# Altium schematic sheet power_sw.SchDoc
size A4
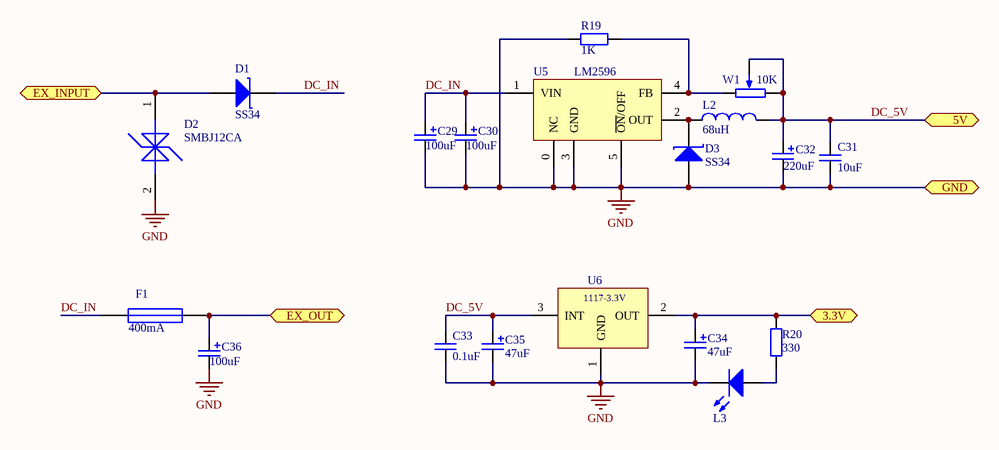
[diagram p0: power_sw.SchDoc]

## Parts
C29  value 100uF  [ECAP_S]  (hidden comment: CAP 330uF)
C30  value 100uF  [ECAP_S]  (hidden comment: CAP 330uF)
C31  value 10uF  [CAP-0805]  (hidden comment: CAP)
C32  value 220uF  [ECAP_S]  (hidden comment: CAP 330uF)
C33  value 0.1uF  [CAP-0805]  (hidden comment: CAP)
C34  value 47uF  [CAP_B]  (hidden comment: CAP 10UF)
C35  value 47uF  [CAP_B]  (hidden comment: CAP 10UF)
C36  value 100uF  [ECAP_S]  (hidden comment: CAP 330uF)
D1  SS34  [DO214AC]
D2  SMBJ12CA  [DO214AB]
D3  SS34  [DO214AC]
F1  400mA  [MF_R030]
L2  value 68uH  [PWR_L]  (hidden comment: INDUCTOR)
L3  LED  [LED-0805]  (value not drawn)
R19  value 1K  [RES-0805]  (hidden comment: RES)
R20  value 330  [RES-0805]  (hidden comment: RES)
U5  LM2596  [TO263]
U6  AMS117-3V3  [AMS1117]  (value not drawn)
W1  value 10K  [RESPOT1]  (hidden comment: RESPOT)

## Ports
3.3V, 5V, EX_INPUT, EX_OUT, GND

## Nets
GND: C29.2 C30.2 C31.1 C32.2 C33.1 C34.2 C35.2 C36.2 D2.2 D3.1 L3.2 R19.1 U5.0(NC) U5.3(GND) U5.5(~{ON}/OFF) U6.1(GND) ; port GND
3.3V: C34.1 R20.2 U6.2(OUT) ; port 3.3V
DC_5V: C31.2 C32.1 C33.2 C35.1 L2.2 U6.3(INT) W1.2 W1.3 ; port 5V
DC_IN: C29.1 C30.1 D1.2 F1.1 U5.1(VIN)
EX_INPUT: D1.1 D2.1 ; port EX_INPUT
EX_OUT: C36.1 F1.2 ; port EX_OUT
NetD3_2: D3.2 L2.1 U5.2(OUT)
NetL3_1: L3.1 R20.1
NetR19_2: R19.2 U5.4(FB) W1.1

## Notes on the sheet
- (in symbol AMS117-3V3) 1117-3.3V

## Library data of the parts
D2 = SMBJ30CA
F1 = MF_R030
U5 = LM2576/96